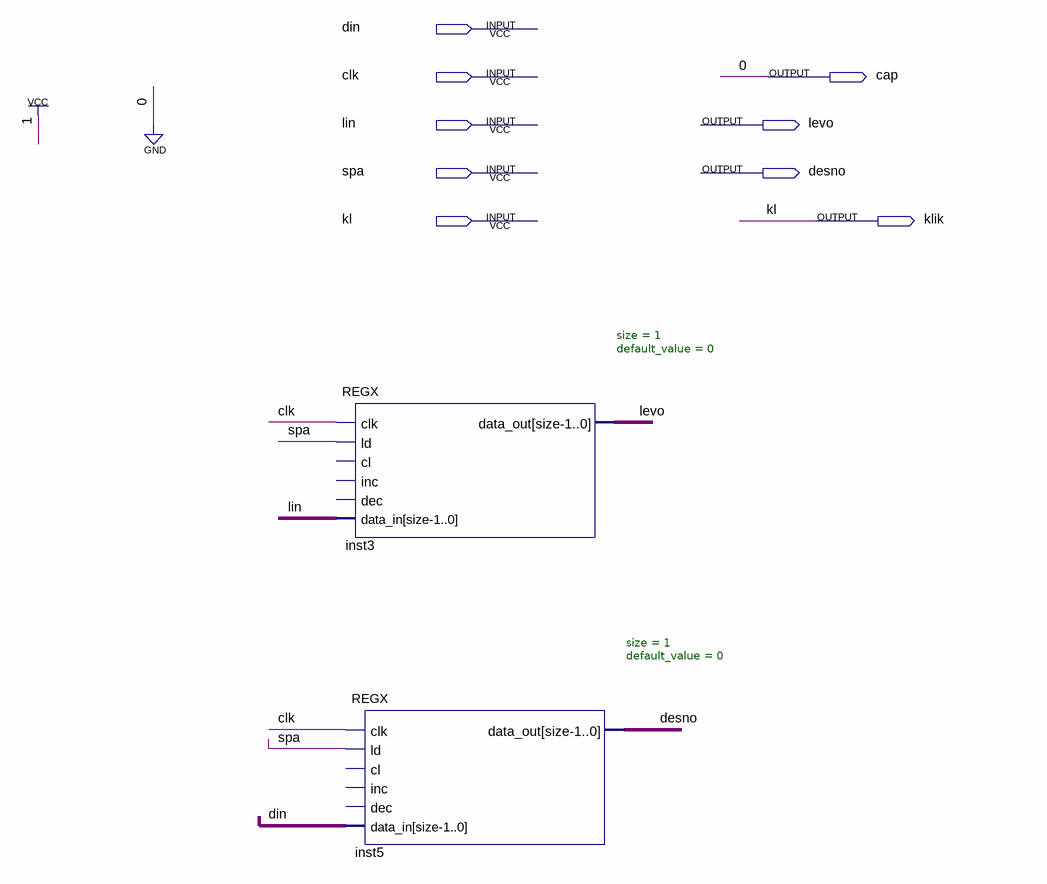
[diagram p0: schematic sheet]
// Quartus schematic prijem.bdf as structural Verilog: 2 symbols, 9 pins
module prijem (
  input  din,
  input  clk,
  input  lin,
  input  spa,
  input  kl,
  output cap,
  output levo,
  output desno,
  output klik
);

  REGX #(.size(1), .default_value(0)) inst3 (
    .clk(clk), .ld(spa), .data_in(lin), .data_out(levo));  // open: cl, inc, dec
  REGX #(.size(1), .default_value(0)) inst5 (
    .clk(clk), .ld(spa), .data_in(din), .data_out(desno));  // open: cl, inc, dec

  assign cap = 1'b0;
  assign klik = kl;
endmodule
